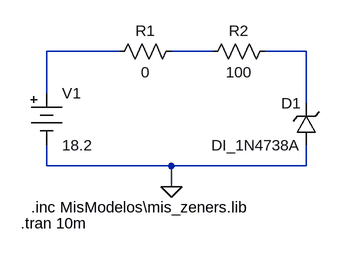
[diagram p0: schematic Zener1N4738ValoresComercialesCaso1.asc]
Zener1N4738ValoresComercialesCaso1.asc, the LTspice schematic file:
Version 4.1
SHEET 1 880 680
WIRE 160 64 48 64
WIRE 304 64 240 64
WIRE 448 64 384 64
WIRE 48 128 48 64
WIRE 448 144 448 64
WIRE 48 240 48 208
WIRE 240 240 48 240
WIRE 448 240 448 208
WIRE 448 240 240 240
WIRE 240 272 240 240
FLAG 240 272 0
SYMBOL Misc\\battery 48 112 R0
SYMATTR InstName V1
SYMATTR Value 18.2
SYMBOL res 256 48 R90
WINDOW 0 0 56 VBottom 2
WINDOW 3 32 56 VTop 2
SYMATTR InstName R1
SYMATTR Value 0
SYMBOL res 400 48 R90
WINDOW 0 0 56 VBottom 2
WINDOW 3 32 56 VTop 2
SYMATTR InstName R2
SYMATTR Value 100
SYMBOL zener 464 208 R180
WINDOW 0 24 64 Left 2
WINDOW 3 24 0 Left 2
SYMATTR InstName D1
SYMATTR Value DI_1N4738A
SYMATTR Prefix x
TEXT 24 304 Left 2 !.inc MisModelos\\mis_zeners.lib
TEXT 8 328 Left 2 !.tran 10m

The netlist it stands for:
* Zener1N4738ValoresComercialesCaso1.asc
V1 N001 0 18.2
R1 N002 N001 0
R2 N003 N002 100
X§D1 0 N003 DI_1N4738A  ; pins + -
.inc MisModelos\mis_zeners.lib
.tran 10m
.backanno
.end